# EasyEDA Pro project novadac.eprj, schematic 6-channel DAC for Data General

## Sheets
1 P1: Board Name: Board1; Create Date: 2026-02-04; Page Name: P1; Project Name: novadac; Schematic Name: 6-channel DAC for Data General; Update Date: 2026-02-23; Company: Gata Deneral; Drawn: Ø. Hammer; Page Size: A4; Version: V1.0
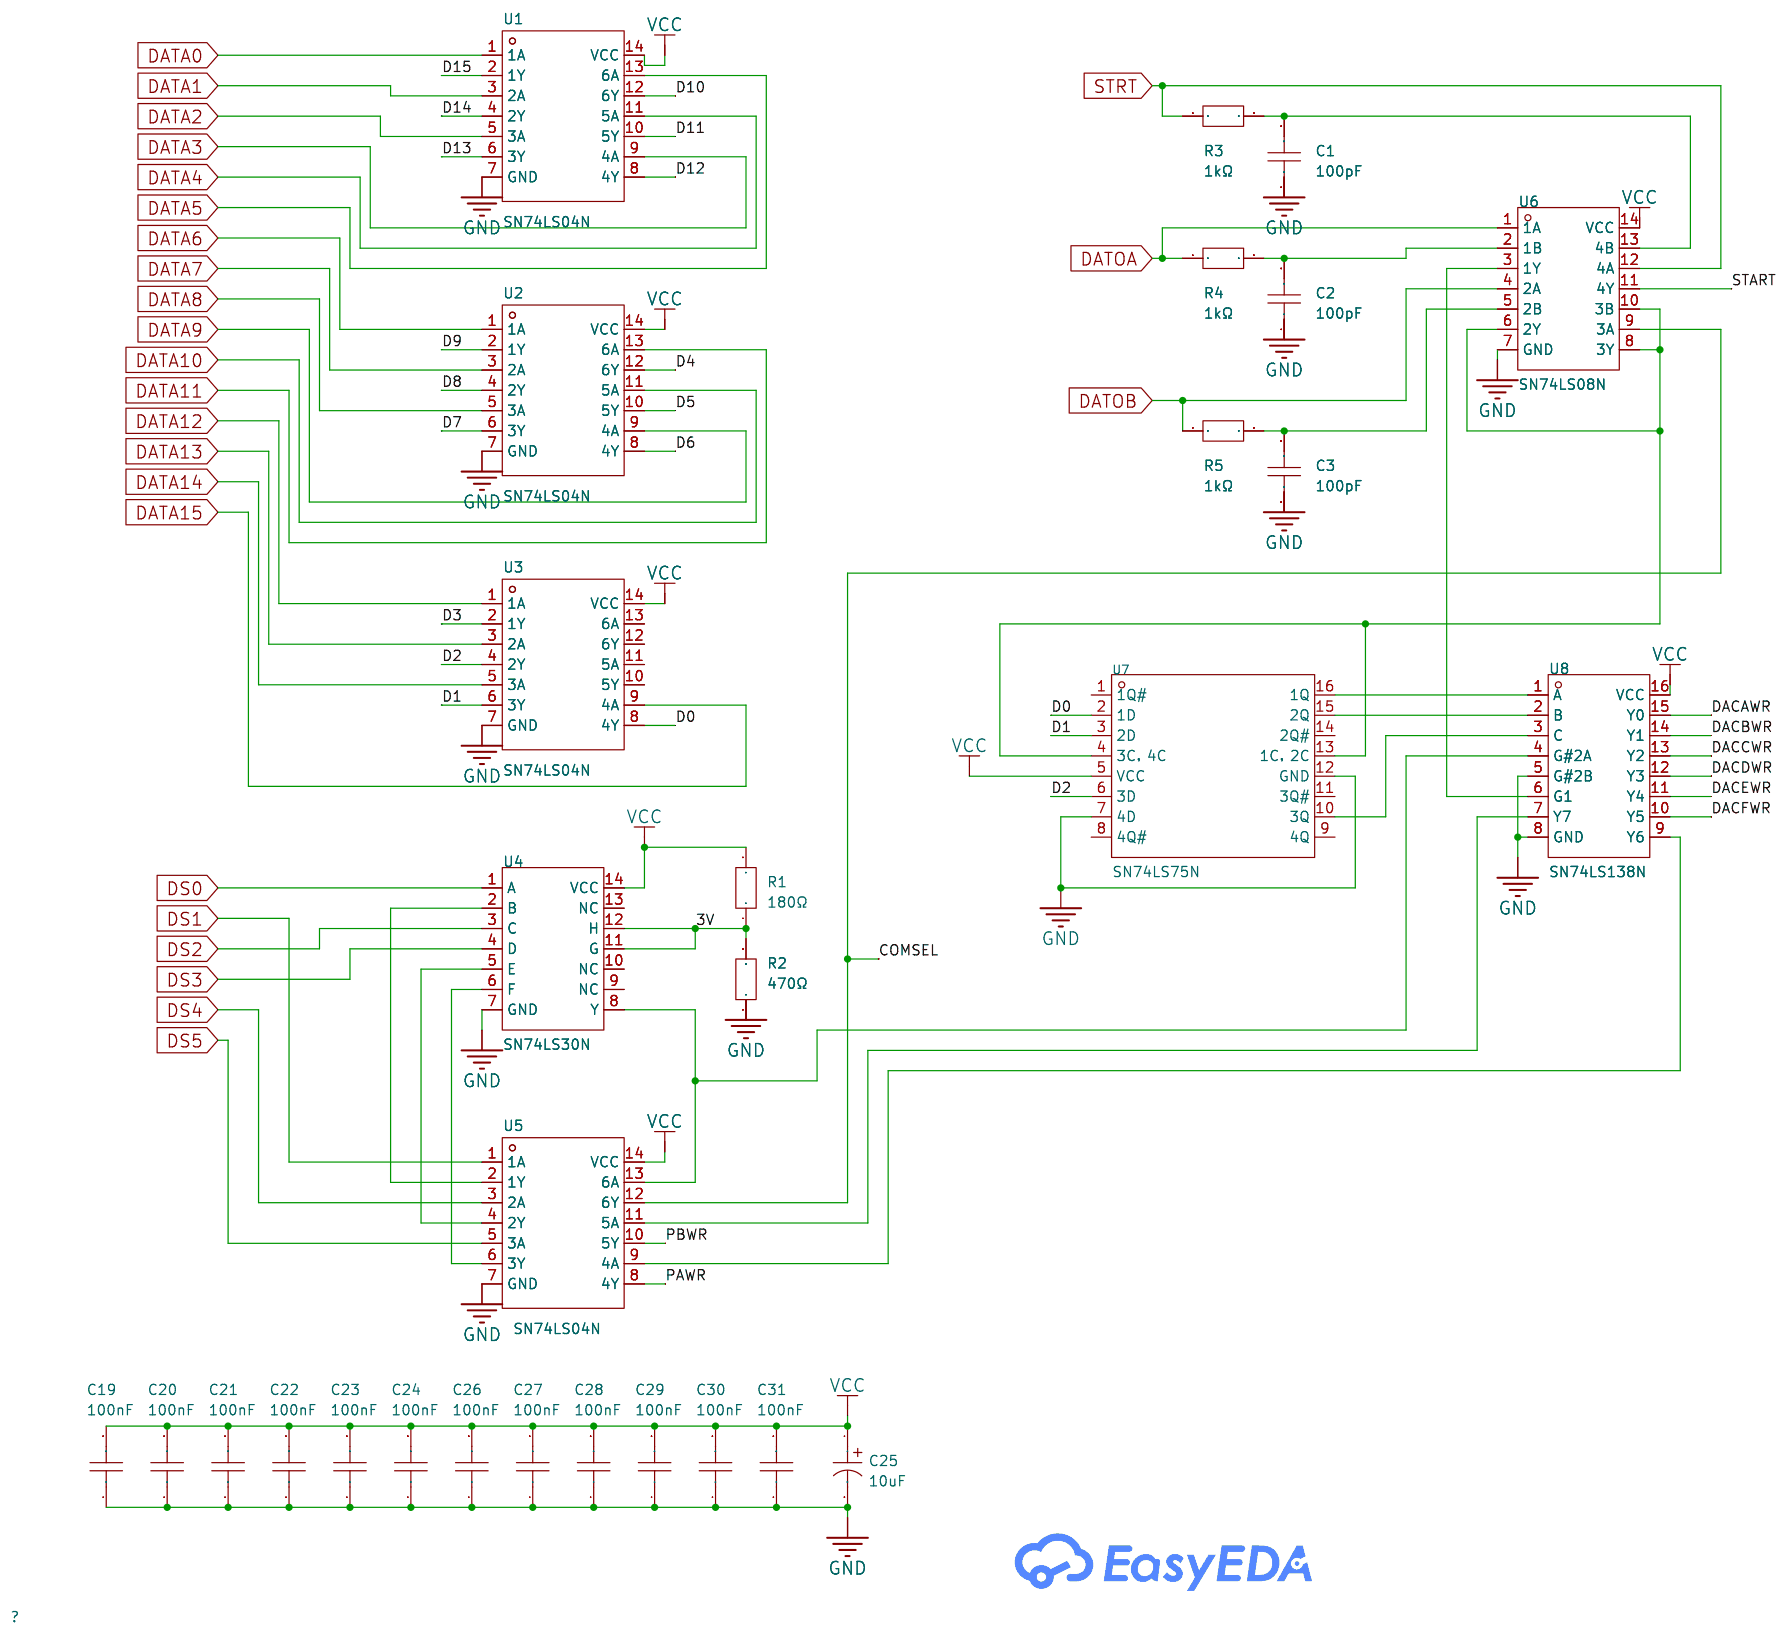
[diagram p0: P1]
2 P2: Create Date: 2026-02-21; Page Name: P2; Update Date: 2026-02-24; Company: EasyEDA.com
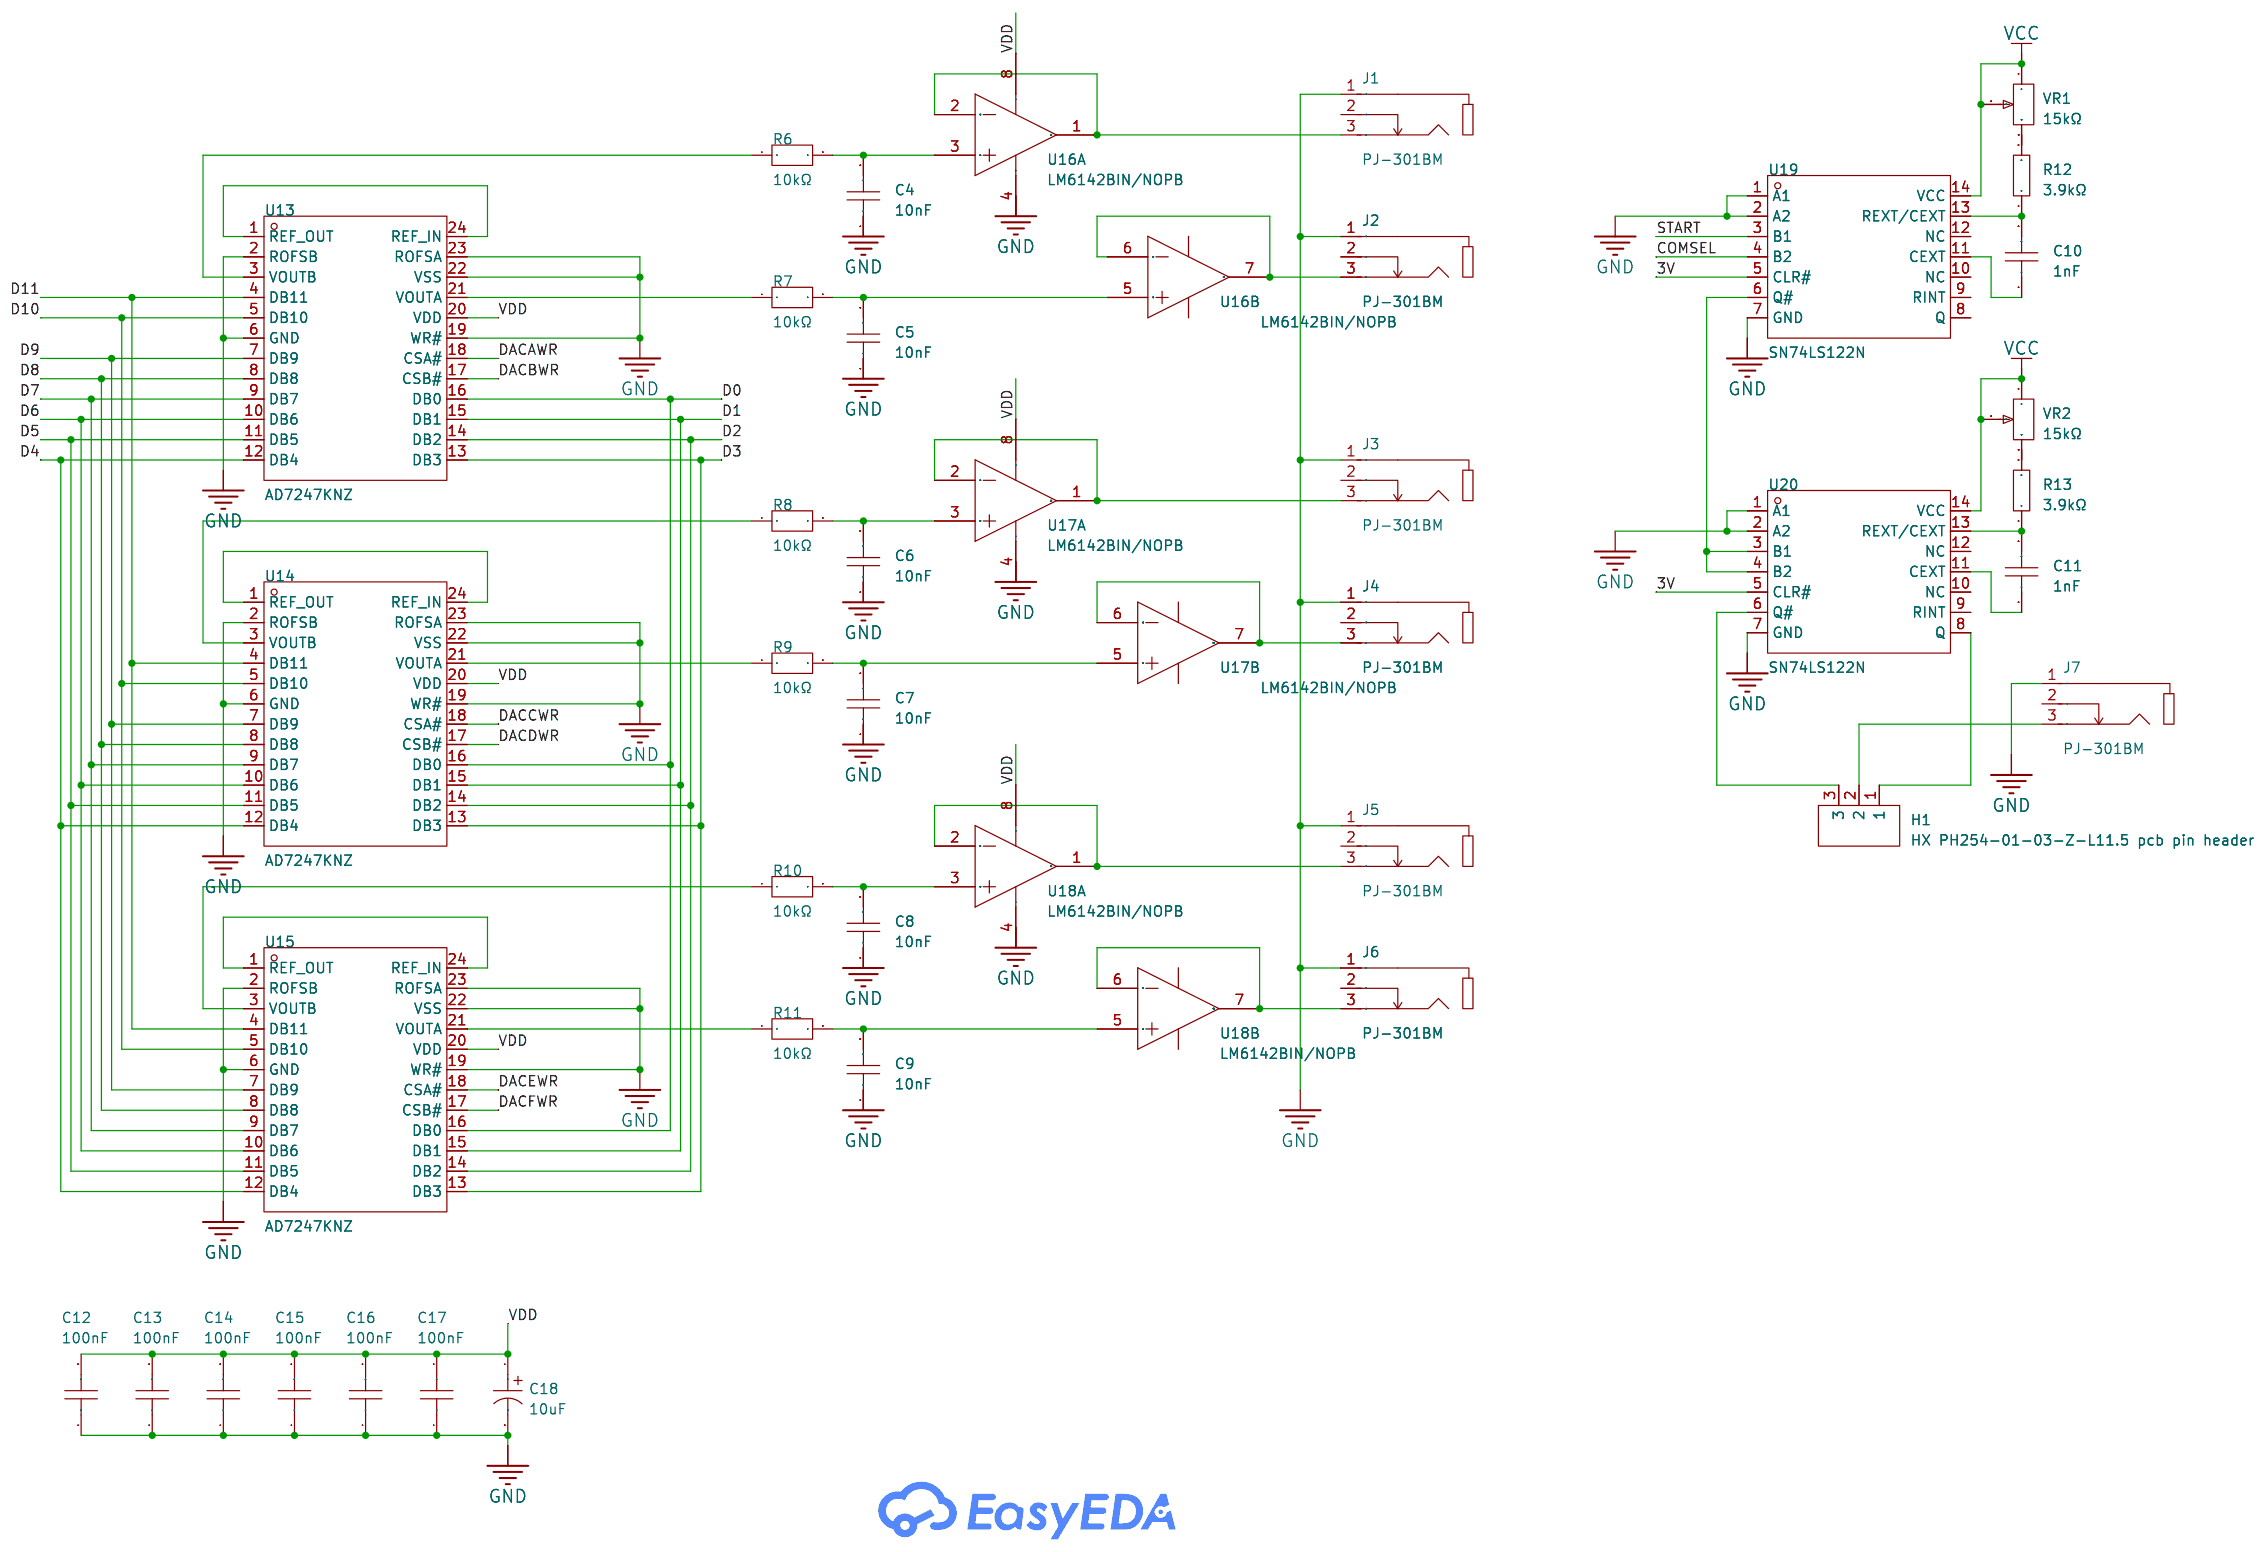
[diagram p1: P2]
3 P3: Create Date: 2026-02-23; Page Name: P3; Update Date: 2026-02-24; Company: EasyEDA.com
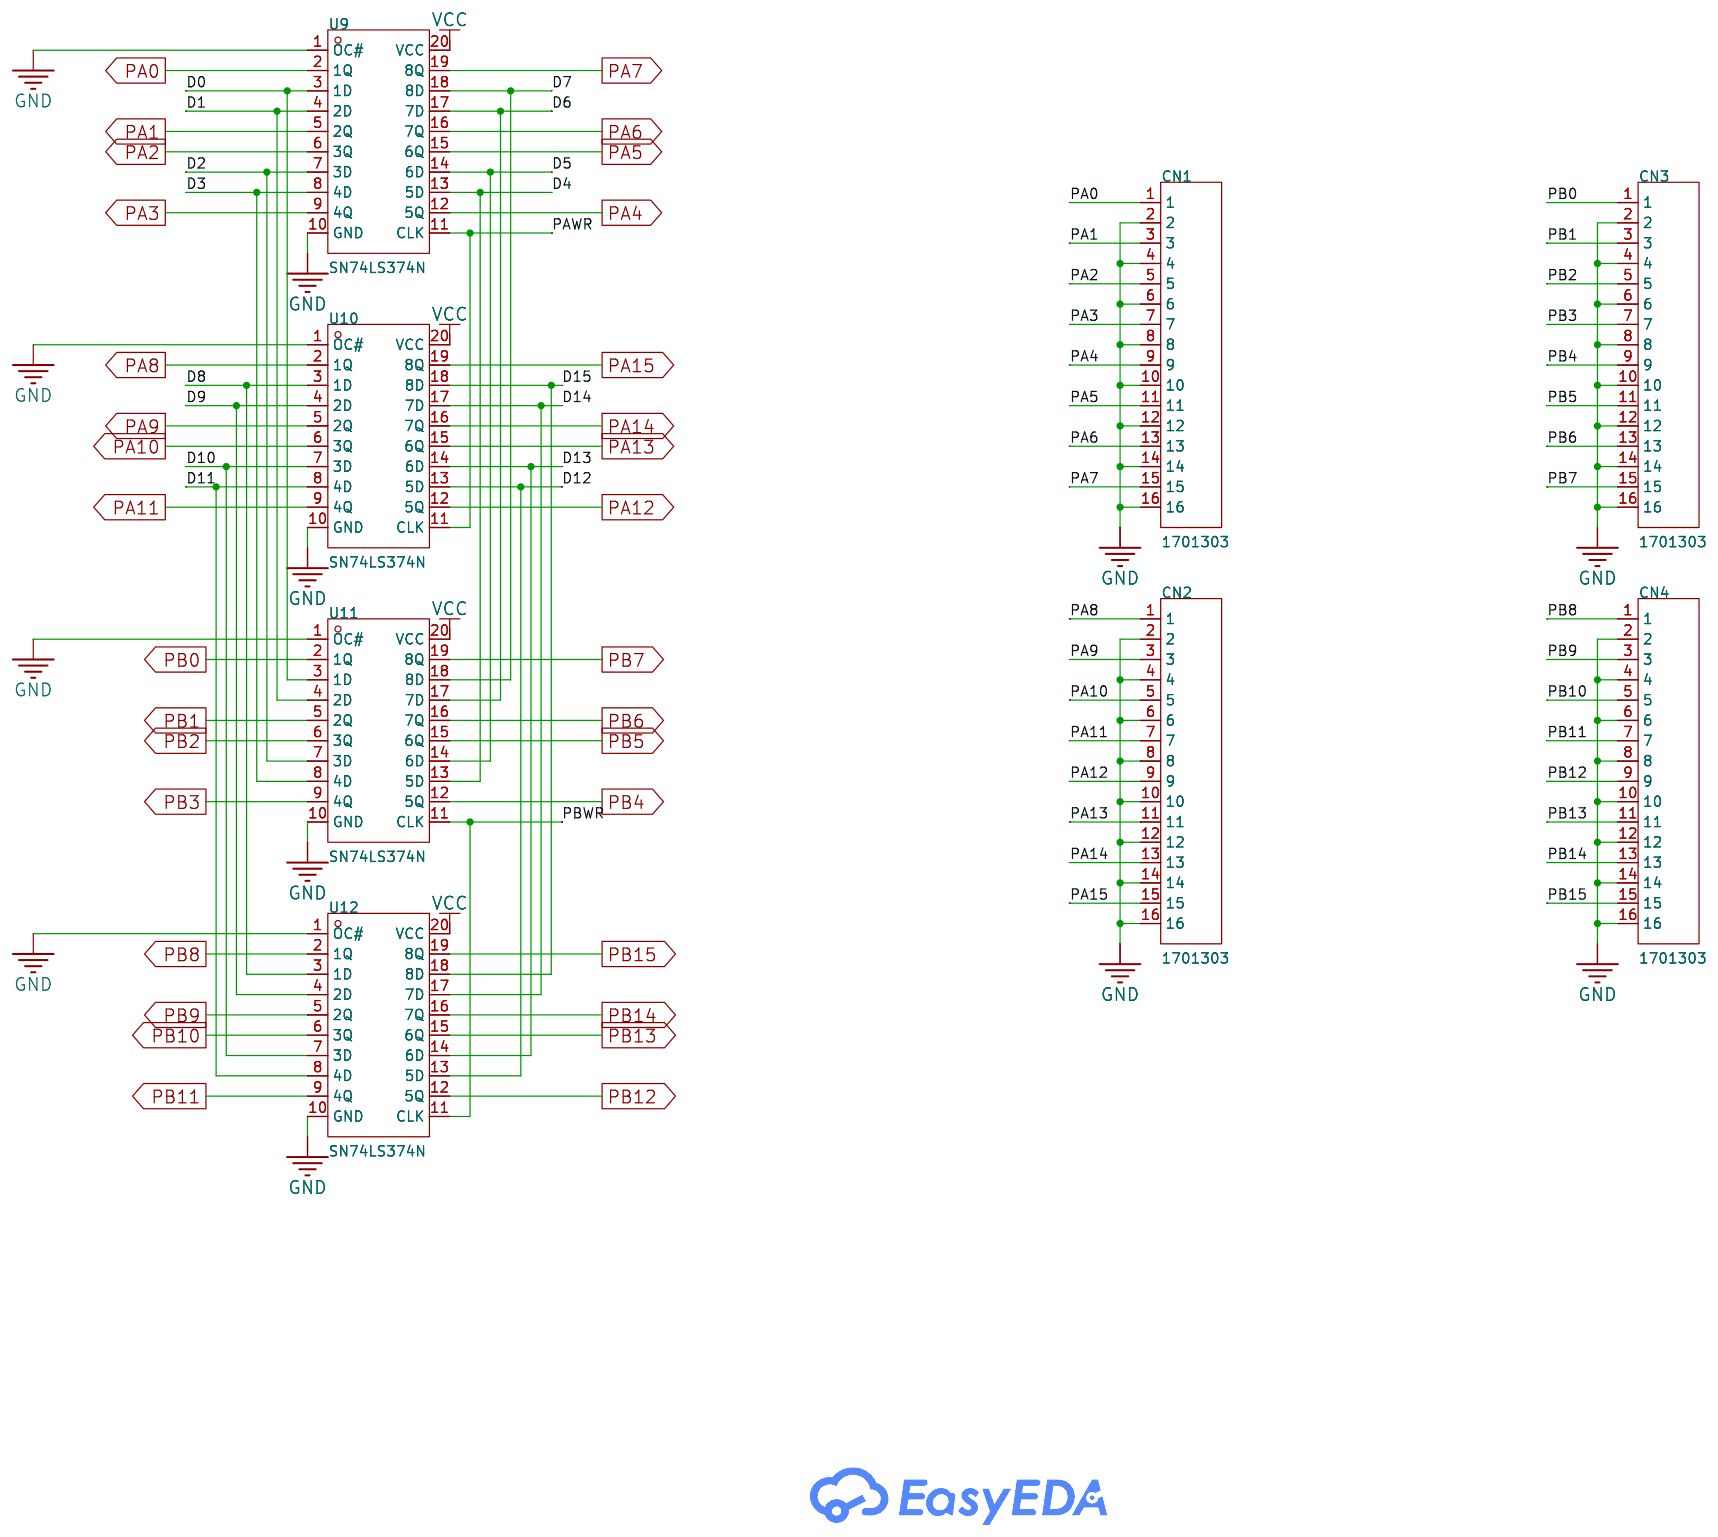
[diagram p2: P3]

## Parts
sheet P1
C1  100pF  [CAP-TH_L6.3-W2.6-P5.08-D0.5]
C2  100pF  [CAP-TH_L6.3-W2.6-P5.08-D0.5]
C3  100pF  [CAP-TH_L6.3-W2.6-P5.08-D0.5]
C19  100nF  [CAP-TH_L6.5-W4.0-P5.00-D0.6-S1.20]
C20  100nF  [CAP-TH_L6.5-W4.0-P5.00-D0.6-S1.20]
C21  100nF  [CAP-TH_L6.5-W4.0-P5.00-D0.6-S1.20]
C22  100nF  [CAP-TH_L6.5-W4.0-P5.00-D0.6-S1.20]
C23  100nF  [CAP-TH_L6.5-W4.0-P5.00-D0.6-S1.20]
C24  100nF  [CAP-TH_L6.5-W4.0-P5.00-D0.6-S1.20]
C25  10uF  [CAP-TH_BD5.0-P2.00-D0.5-FD]
C26  100nF  [CAP-TH_L6.5-W4.0-P5.00-D0.6-S1.20]
C27  100nF  [CAP-TH_L6.5-W4.0-P5.00-D0.6-S1.20]
C28  100nF  [CAP-TH_L6.5-W4.0-P5.00-D0.6-S1.20]
C29  100nF  [CAP-TH_L6.5-W4.0-P5.00-D0.6-S1.20]
C30  100nF  [CAP-TH_L6.5-W4.0-P5.00-D0.6-S1.20]
C31  100nF  [CAP-TH_L6.5-W4.0-P5.00-D0.6-S1.20]
R1  180Ω  [RES-TH_BD2.3-L6.0-P10.00-D0.4]
R2  470Ω  [RES-TH_BD2.5-L6.8-P10.50-D0.5]
R3  1kΩ  [RES-TH_BD2.4-L6.5-P10.50-D0.5]
R4  1kΩ  [RES-TH_BD2.4-L6.5-P10.50-D0.5]
R5  1kΩ  [RES-TH_BD2.4-L6.5-P10.50-D0.5]
U1  SN74LS04N  [PDIP-14_L19.7-W6.6-P2.54-LS8.3-BL]
U2  SN74LS04N  [PDIP-14_L19.7-W6.6-P2.54-LS8.3-BL]
U3  SN74LS04N  [PDIP-14_L19.7-W6.6-P2.54-LS8.3-BL]
U4  SN74LS30N  [PDIP-14_L19.6-W6.5-P2.54-LS7.9-BL]
U5  SN74LS04N  [PDIP-14_L19.7-W6.6-P2.54-LS8.3-BL]
U6  SN74LS08N  [PDIP-14_L19.3-W6.4-P2.54-LS7.9-BL-1]
U7  SN74LS75N  [DIP-16_L20.0-W6.4-P2.54-LS7.6-BL]
U8  SN74LS138N  [DIP-16_L19.8-W6.5-P2.54-LS7.6-BL]
sheet P2
C4  10nF  [CAP-TH_L12.0-W5.0-P7.50-D0.6]
C5  10nF  [CAP-TH_L12.0-W5.0-P7.50-D0.6]
C6  10nF  [CAP-TH_L12.0-W5.0-P7.50-D0.6]
C7  10nF  [CAP-TH_L12.0-W5.0-P7.50-D0.6]
C8  10nF  [CAP-TH_L12.0-W5.0-P7.50-D0.6]
C9  10nF  [CAP-TH_L12.0-W5.0-P7.50-D0.6]
C10  1nF  [CAP-TH_L8.4-W5.0-P6.40-D0.8-S2.5]
C11  1nF  [CAP-TH_L8.4-W5.0-P6.40-D0.8-S2.5]
C12  100nF  [CAP-TH_L6.5-W4.0-P5.00-D0.6-S1.20]
C13  100nF  [CAP-TH_L6.5-W4.0-P5.00-D0.6-S1.20]
C14  100nF  [CAP-TH_L6.5-W4.0-P5.00-D0.6-S1.20]
C15  100nF  [CAP-TH_L6.5-W4.0-P5.00-D0.6-S1.20]
C16  100nF  [CAP-TH_L6.5-W4.0-P5.00-D0.6-S1.20]
C17  100nF  [CAP-TH_L6.5-W4.0-P5.00-D0.6-S1.20]
C18  10uF  [CAP-TH_BD5.0-P2.00-D0.5-FD]
H1  HX PH254-01-03-Z-L11.5 pcb pin header  [HDR-TH_3P-P2.54-V-M-1]
J1  PJ-301BM  [AUDIO-TH_PJ-301BM]
J2  PJ-301BM  [AUDIO-TH_PJ-301BM]
J3  PJ-301BM  [AUDIO-TH_PJ-301BM]
J4  PJ-301BM  [AUDIO-TH_PJ-301BM]
J5  PJ-301BM  [AUDIO-TH_PJ-301BM]
J6  PJ-301BM  [AUDIO-TH_PJ-301BM]
J7  PJ-301BM  [AUDIO-TH_PJ-301BM]
R6  10kΩ  [RES-TH_BD2.3-L6.0-P10.00-D0.6]
R7  10kΩ  [RES-TH_BD2.3-L6.0-P10.00-D0.6]
R8  10kΩ  [RES-TH_BD2.3-L6.0-P10.00-D0.6]
R9  10kΩ  [RES-TH_BD2.3-L6.0-P10.00-D0.6]
R10  10kΩ  [RES-TH_BD2.3-L6.0-P10.00-D0.6]
R11  10kΩ  [RES-TH_BD2.3-L6.0-P10.00-D0.6]
R12  3.9kΩ  [RES-TH_BD2.2-L6.5-P10.50-D0.6]
R13  3.9kΩ  [RES-TH_BD2.2-L6.5-P10.50-D0.6]
U13  AD7247KNZ  [PDIP-24_L32.5-W6.5-P2.54-LS7.9-BL]
U14  AD7247KNZ  [PDIP-24_L32.5-W6.5-P2.54-LS7.9-BL]
U15  AD7247KNZ  [PDIP-24_L32.5-W6.5-P2.54-LS7.9-BL]
U16  LM6142BIN/NOPB  [PDIP-8_L9.6-W6.4-P2.54-LS7.9-BL]  (sections 1,2)
U17  LM6142BIN/NOPB  [PDIP-8_L9.6-W6.4-P2.54-LS7.9-BL]  (sections 1,2)
U18  LM6142BIN/NOPB  [PDIP-8_L9.6-W6.4-P2.54-LS7.9-BL]  (sections 1,2)
U19  SN74LS122N  [PDIP-14_L19.2-W6.6-P2.54-LS7.6-BL]
U20  SN74LS122N  [PDIP-14_L19.2-W6.6-P2.54-LS7.6-BL]
VR1  15kΩ  [RES-ADJ-TH_3362P]
VR2  15kΩ  [RES-ADJ-TH_3362P]
sheet P3
CN1  1701303  [CONN-TH_1701303]
CN2  1701303  [CONN-TH_1701303]
CN3  1701303  [CONN-TH_1701303]
CN4  1701303  [CONN-TH_1701303]
U9  SN74LS374N  [PDIP-20_L25.4-W6.4-P2.54-LS7.6-BL]
U10  SN74LS374N  [PDIP-20_L25.4-W6.4-P2.54-LS7.6-BL]
U11  SN74LS374N  [PDIP-20_L25.4-W6.4-P2.54-LS7.6-BL]
U12  SN74LS374N  [PDIP-20_L25.4-W6.4-P2.54-LS7.6-BL]

## Library data of the parts
C1-C3 = CC1H101JC14DSL6B1100: LCSC Part Name: 100pF ±5% 50V; Supplier Part: C37323966; Manufacturer: Dersonic(德尔创); Supplier Footprint: 插件,P=5.08mm; JLCPCB Part Class: Extended Part; Datasheet: https://item.szlcsc.com/datasheet/CC1H101JC14DSL6B1100/39053442.html; Supplier: LCSC; Tolerance: ±5%; Voltage Rating: 50V; Diameter: 6.3mm; Body Thickness: 2.6mm
C12-C17 C19-C24 C26-C31 = DCS104Z26Y5VF6FJ5A0: LCSC Part Name: 100nF -20%~+80% 50V; Supplier Part: C2896071; Manufacturer: SHM(南方宏明); Supplier Footprint: 插件,P=5mm; JLCPCB Part Class: Extended Part; Datasheet: https://item.szlcsc.com/datasheet/DCS104Z26Y5VF6FJ5A0/3138620.html; Supplier: LCSC; Tolerance: -20%~+80%; Voltage Rating: 50V; Pin Spacing: 5mm; Temperature Coefficient: Y5V
C18 C25 = ECA-1HHG100I: LCSC Part Name: 10uF ±20% 50V; Supplier Part: C1579480; Manufacturer: PANASONIC(松下); Supplier Footprint: 插件,D5xL11mm; JLCPCB Part Class: Extended Part; Datasheet: https://item.szlcsc.com/datasheet/ECA-1HHG100I/1670295.html; Supplier: LCSC; Tolerance: ±20%; Voltage Rating: 50V; Ripple Current: 78mA@100kHz; Pin Spacing: 2.5mm; Diameter: 5mm; Height - Seated (Max): 11mm; Lifetime: 1000hrs@105℃; Operating Temperature: -55℃~+105℃
R1 = CF14JT180R: LCSC Part Name: 碳膜电阻 180Ω ±5% 250mW; Supplier Part: C2441444; Manufacturer: SEI(Stackpole Electronics Inc.); Supplier Footprint: 插件,D2.3xL6mm; JLCPCB Part Class: Extended Part; Datasheet: https://atta.szlcsc.com/upload/public/pdf/source/20210415/C3B0A20144BFAD658339FB54402F100E.pdf; Supplier: LCSC; Type: Carbon Resister; Tolerance: ±5%; Power(Watts): 0.25W; Temperature Coefficient: -400ppm/℃~0ppm/℃; Operating Temperature Range: -55℃~+155℃
R2 = OK4715E-R52: LCSC Part Name: 碳膜电阻 470Ω ±5% 250mW; Supplier Part: C2585640; Manufacturer: Ohmite; Supplier Footprint: 插件,D2.5xL6.8mm; JLCPCB Part Class: Extended Part; Datasheet: https://atta.szlcsc.com/upload/public/pdf/source/20210606/44E8E817E1A17D88343A8FCFA8E94EF6.pdf; Supplier: LCSC; Type: Carbon Resister; Tolerance: ±5%; Power(Watts): 0.25W; Temperature Coefficient: -450ppm/℃
R3-R5 = PRNF14FTD1K00: LCSC Part Name: 金属膜电阻 1kΩ ±1% 250mW; Supplier Part: C2587677; Manufacturer: SEI(Stackpole Electronics Inc.); Supplier Footprint: 插件,D2.4xL6.4mm; JLCPCB Part Class: Extended Part; Datasheet: https://atta.szlcsc.com/upload/public/pdf/source/20210416/CE3C3DFE1F0E2A8D22EC743938724C43.pdf; Supplier: LCSC; Type: Metal Film Resistors; Tolerance: ±1%; Power(Watts): 0.25W; Temperature Coefficient: ±100ppm/℃; Operating Temperature Range: -55℃~+155℃
U1-U3 U5 = SN74LS04N: Supplier Part: C183657; Manufacturer: TI(德州仪器); Supplier Footprint: PDIP-14; JLCPCB Part Class: Extended Part; Datasheet: https://www.ti.com/cn/lit/gpn/sn74ls04; Supplier: LCSC; Voltage - Supply: 4.75V~5.25V; Number of Circuits: 6; Number of Inputs: 1; Current - Output Low(IOL): 8mA; Current - Output High(IOH): 400uA; Input Logic Level - High: 2V; Input Logic Level -Low: 800mV; Max Propagation Delay: 15ns@5V,15pF; Series: 74LSSeries; Operating Temperature: 0℃~+70℃
U4 = SN74LS30N: LCSC Part Name: 八输入正与非门; Supplier Part: C2879098; Manufacturer: TI(德州仪器); Supplier Footprint: PDIP-14; JLCPCB Part Class: Extended Part; Datasheet: https://www.ti.com/cn/lit/gpn/sn5430; Supplier: LCSC; Logic Type: NAND Gate; Number of Channels: 1; Voltage - Supply: 4.75V~5.25V; Quiescent Current: 500uA; Current - Output Low(IOL): 8mA; Current - Output High(IOH): 400uA; Input Logic Level - High: 2V; Input Logic Level - Low: 800mV; Output Logic Level - High: 2.7V~3.4V; Output Logic Level - Low: 500mV; Series: 74LS Series; Propagation Delay: 20ns@5V,15pF; Operating Temperature: 0℃~+70℃; Input Number: 8
U6 = SN74LS08N: Supplier Part: C2869595; Manufacturer: TI(德州仪器); Supplier Footprint: PDIP-14; JLCPCB Part Class: Extended Part; Datasheet: https://www.ti.com/cn/lit/gpn/sn54s08; Supplier: LCSC; Logic Type: AND Gate; Number of Channels: 4; Voltage - Supply: 4.75V~5.25V; Current - Output Low(IOL): 8mA; Current - Output High(IOH): 400uA; Input Logic Level - High: 2V; Input Logic Level - Low: 800mV; Series: 74LSSeries; Operating Temperature: 0℃~+70℃
U7 = SN74LS75N: LCSC Part Name: 差分输出D型锁存器; Supplier Part: C133843; Manufacturer: TI(德州仪器); Supplier Footprint: DIP-16; JLCPCB Part Class: Extended Part; Datasheet: https://www.ti.com/cn/lit/gpn/sn74ls75; Supplier: LCSC; Logic Type: D-Typelocking器; Output Type: Differential; Supply Voltage: 4.75V~5.25V; Source Current: 400uA; Sink Current: 8mA; Propagation Delay: 9ns; OperatingTemperature: 0℃~+70℃
U8 = SN74LS138N: Supplier Part: C352964; Manufacturer: TI(德州仪器); Supplier Footprint: DIP-16; JLCPCB Part Class: Extended Part; Datasheet: https://www.ti.com/cn/lit/gpn/sn74ls138; Supplier: LCSC; Type: Decoder; Voltage Supply Source: Single Supply; Voltage - Supply: 4.75V~5.25V; Current - Output Low(IOL): 8mA; Current - Output High(IOH): 400uA; Operating temperature: 0℃~+70℃; Propagation Delay: 41ns@5V,15pF; Quiescent Current: 10mA
C4-C9 = CT81-M12Y5V1D103MSE: LCSC Part Name: 10nF ±20% 2kV; Supplier Part: C2961300; Manufacturer: FH(风华); Supplier Footprint: 插件,P=7.5mm; JLCPCB Part Class: Extended Part; Datasheet: https://item.szlcsc.com/datasheet/CT81-M12Y5V1D103MSE/3349498.html; Supplier: LCSC; Tolerance: ±20%; Voltage Rating: 2kV; Pin Spacing: 7.5mm; Temperature Coefficient: Y5V
C10 C11 = 564R30GAD10: LCSC Part Name: 1nF ±20% 3kV; Supplier Part: C1621681; Manufacturer: VISHAY(威世); Supplier Footprint: 插件,P=6.4mm; JLCPCB Part Class: Extended Part; Datasheet: https://item.szlcsc.com/datasheet/564R30GAD10/1712527.html; Supplier: LCSC; Tolerance: ±20%; Voltage Rating: 3kV; Pin Spacing: 6.4mm; Temperature Coefficient: Z5U; Diameter: 8.4mm
H1 = HX PH254-01-03-Z-L11.5 pcb pin header: LCSC Part Name: 1x3P 间距:2.54mm 方针 直插; Supplier Part: C52016391; Manufacturer: hanxia(韩下); Supplier Footprint: 插件,P=2.54mm; JLCPCB Part Class: Extended Part; Datasheet: https://item.szlcsc.com/datasheet/HX%2520PH254-01-03-Z-L11.5%2520pcb%2520pin%2520header/54760436.html; Supplier: LCSC; Pin Structure: 1x3P; Pitch: 2.54mm; Circluar Pins/Square Pins: Pin Header; Mounting Type: Through Hole; Number of Rows: 1; Number of Pins: 3P; Current Rating: 3A; Voltage Rating (Max): 1kV; Length of Mating Pin: 6mm; Insulation Height: 2.5mm; Length of End Connection Pin: 3mm; Contact Material: Brass; Contact Plating: Gold; Operating Temperature: -40℃~+105℃
J1-J7 = PJ-301BM: Supplier Part: C5449358; Supplier Footprint: 3.5mmJack; JLCPCB Part Class: Extended Part; Supplier: LCSC
R6-R11 = PCF14JA4K70: LCSC Part Name: 碳膜电阻 4.7kΩ ±5% 250mW; Supplier Part: C2643539; Manufacturer: SEI(Stackpole Electronics Inc.); Supplier Footprint: 插件,D2.3xL6mm; JLCPCB Part Class: Extended Part; Datasheet: https://atta.szlcsc.com/upload/public/pdf/source/20210415/C3B0A20144BFAD658339FB54402F100E.pdf; Supplier: LCSC; Type: Carbon Resister; Tolerance: ±5%; Power(Watts): 0.25W; Temperature Coefficient: -400ppm/℃~0ppm/℃; Operating Temperature Range: -55℃~+155℃
R12 R13 = MFR-25FTE52-3K9: LCSC Part Name: 金属膜电阻 3.9kΩ ±1% 250mW 铜脚，圆柱状直插; Supplier Part: C173016; Manufacturer: YAGEO(国巨); Supplier Footprint: 插件,D2.4xL6.3mm; JLCPCB Part Class: Extended Part; Datasheet: https://atta.szlcsc.com/upload/public/pdf/source/20191118/C457825_18355E864DE4965678DC27B0EBC3E21E.pdf; Supplier: LCSC; Type: Metal Film Resistors; Tolerance: ±1%; Power(Watts): 250mW; Temperature Coefficient: ±50ppm/℃; Operating Temperature: -55℃~+155℃
U13-U15 = AD7247KNZ: LCSC Part Name: 双通道12位DACPORT，采用并行加载结构; Supplier Part: C650711; Manufacturer: ADI(亚德诺); Supplier Footprint: PDIP-24; JLCPCB Part Class: Extended Part; Datasheet: https://atta.szlcsc.com/upload/public/pdf/source/20220519/CFA01A62AC52BA1354AA6BF420D4E076.pdf; Supplier: LCSC; Resolution: 12 Bits; Interface: Parallel; Supply Voltage: 15V; Settling Time: 10us; Output Type: Voltage Buffer; Integral nonlinearity: 0.5LSB；0.9LSB; Operating Temperature: -40℃~+85℃
U16-U18 = LM6142BIN/NOPB: LCSC Part Name: 17 MHz 轨到轨输入输出运算放大器; Supplier Part: C1347342; Manufacturer: TI(德州仪器); Supplier Footprint: PDIP-8; JLCPCB Part Class: Extended Part; Datasheet: https://www.ti.com/cn/lit/gpn/lm6144; Supplier: LCSC; Number of Channels: 2; Maximum Power Supply Range (Vdd-Vss): 24V; Rail to Rail: Rail-to-Rail Input, Rail-to-Rail Output; Gain Bandwidth Product: 17MHz; Vos - Input Offset Voltage: 3.3mV; Input Offset Voltage Drift(Vos TC): 3uV/℃; Slew Rate: 25V/us; Ib - Input Bias Current: 170nA; Input Offset Current(Ios): 80nA; Noise density(eN): 16nV/√Hz@1kHz; Common Mode Rejection Ratio(CMRR): 84dB; Quiescent Current: 650uA; Output Current: 35mA; Operating Temperature: -40℃~+85℃; Single supply: 1.8V~24V
U19 U20 = SN74LS122N: LCSC Part Name: 可触发单稳态多谐振荡器; Supplier Part: C1522780; Manufacturer: TI(德州仪器); Supplier Footprint: PDIP-14; JLCPCB Part Class: Extended Part; Datasheet: https://www.ti.com/cn/lit/gpn/sn74ls122; Supplier: LCSC; Logic Type: Monostable; Voltage - Supply: 4.75V~5.25V; Number Of Channels: 1; Input Type: Schmitt Trigger; Quiescent Current: 11mA; Propagation Delay: 28ns; Current - Output Low(IOL): 8mA; Current - Output High(IOH): 400uA; Logic Family: 74LS; Operating Temperature: 0℃~+70℃; Function: 重触发
VR1 VR2 = 3362P-1-103LF: LCSC Part Name: 10kΩ ±10%; Supplier Part: C58159; Manufacturer: BOURNS; Supplier Footprint: 插件-3P,7x6.6mm; JLCPCB Part Class: Extended Part; Datasheet: https://item.szlcsc.com/datasheet/3362P-1-103LF/59198.html; Supplier: LCSC; Tolerance: ±10%; Power(Watts): 500mW; Temperature Coefficient: ±100ppm/℃
CN1-CN4 = 1701303: LCSC Part Name: 5.08mm 排数:1 每排P数:16 直插; Supplier Part: C5872775; Manufacturer: Phoenix Contact(菲尼克斯); Supplier Footprint: 插件,P=5.08mm; JLCPCB Part Class: Extended Part; Datasheet: https://item.szlcsc.com/datasheet/1701303/6806393.html; Supplier: LCSC; Pitch: 5.08mm; Color: Green; Mounting Type: Through Hole; Number of Pins: 16P; Number of Rows: 1; Number of PINs Per Row: 16; Current Rating: 15A; Voltage Rating (Max): 300V
U9-U12 = SN74LS374N: LCSC Part Name: 八位D型透明锁存器和边沿触发触发器; Supplier Part: C1523200; Manufacturer: TI(德州仪器); Supplier Footprint: PDIP-20; JLCPCB Part Class: Extended Part; Datasheet: https://www.ti.com/cn/lit/gpn/sn74ls374; Supplier: LCSC; Type: D-Type; Trigger Type: Rising Edge; Voltage - Supply: 4.75V~5.25V; Clock Frequency: 50MHz; Number of Elements: 1; Number of Bits per Element: 8; Output Type: Tri-State; Propagation Delay: 28ns@5V,45pF; Series: 74LS Series; Current - Output Low(IOL): 24mA; Current - Output High(IOH): 2.6mA; Quiescent Current: 40mA; Operating Temperature: 0℃~+70℃; Setup Time: 20ns; Hold Time: 0ns

## Nets
3V: R1.1 R2.2 U4.11(G) U4.12(H) U19.5(CLR#) U20.5(CLR#)
GND: C1.1 C2.1 C3.1 C4.1 C5.1 C6.1 C7.1 C8.1 C9.1 C12.1 C13.1 C14.1 C15.1 C16.1 C17.1 C18.2 C19.1 C20.1 C21.1 C22.1 C23.1 C24.1 C25.2 C26.1 C27.1 C28.1 C29.1 C30.1 C31.1 CN1.2 CN1.4 CN1.6 CN1.8 CN1.10 CN1.12 CN1.14 CN1.16 CN2.2 CN2.4 CN2.6 CN2.8 CN2.10 CN2.12 CN2.14 CN2.16 CN3.2 CN3.4 CN3.6 CN3.8 CN3.10 CN3.12 CN3.14 CN3.16 CN4.2 CN4.4 CN4.6 CN4.8 CN4.10 CN4.12 CN4.14 CN4.16 J1.1 J2.1 J3.1 J4.1 J5.1 J6.1 J7.1 R2.1 U1.7(GND) U2.7(GND) U3.7(GND) U4.7(GND) U5.7(GND) U6.7(GND) U7.7(4D) U7.12(GND) U8.5(G#2B) U8.8(GND) U9.1(OC#) U9.10(GND) U10.1(OC#) U10.10(GND) U11.1(OC#) U11.10(GND) U12.1(OC#) U12.10(GND) U13.2(ROFSB) U13.6(GND) U13.19(WR#) U13.22(VSS) U13.23(ROFSA) U14.2(ROFSB) U14.6(GND) U14.19(WR#) U14.22(VSS) U14.23(ROFSA) U15.2(ROFSB) U15.6(GND) U15.19(WR#) U15.22(VSS) U15.23(ROFSA) U16.4(V-) U17.4(V-) U18.4(V-) U19.1(A1) U19.2(A2) U19.7(GND) U20.1(A1) U20.2(A2) U20.7(GND)
VCC: C19.2 C20.2 C21.2 C22.2 C23.2 C24.2 C25.1 C26.2 C27.2 C28.2 C29.2 C30.2 C31.2 R1.2 U1.14(VCC) U2.14(VCC) U3.14(VCC) U4.14(VCC) U5.14(VCC) U6.14(VCC) U7.5(VCC) U8.16(VCC) U9.20(VCC) U10.20(VCC) U11.20(VCC) U12.20(VCC) U19.14(VCC) U20.14(VCC) VR1.1 VR1.2 VR2.1 VR2.2
VDD: C12.2 C13.2 C14.2 C15.2 C16.2 C17.2 C18.1 U13.20(VDD) U14.20(VDD) U15.20(VDD) U16.8(V+) U17.8(V+) U18.8(V+)
COMSEL: U5.12(6Y) U6.9(3A) U19.4(B2)
D0: U3.8(4Y) U7.2(1D) U9.3(1D) U11.3(1D) U13.16(DB0) U14.16(DB0) U15.16(DB0)
D1: U3.6(3Y) U7.3(2D) U9.4(2D) U11.4(2D) U13.15(DB1) U14.15(DB1) U15.15(DB1)
D2: U3.4(2Y) U7.6(3D) U9.7(3D) U11.7(3D) U13.14(DB2) U14.14(DB2) U15.14(DB2)
D3: U3.2(1Y) U9.8(4D) U11.8(4D) U13.13(DB3) U14.13(DB3) U15.13(DB3)
D4: U2.12(6Y) U9.13(5D) U11.13(5D) U13.12(DB4) U14.12(DB4) U15.12(DB4)
D5: U2.10(5Y) U9.14(6D) U11.14(6D) U13.11(DB5) U14.11(DB5) U15.11(DB5)
D6: U2.8(4Y) U9.17(7D) U11.17(7D) U13.10(DB6) U14.10(DB6) U15.10(DB6)
D7: U2.6(3Y) U9.18(8D) U11.18(8D) U13.9(DB7) U14.9(DB7) U15.9(DB7)
D8: U2.4(2Y) U10.3(1D) U12.3(1D) U13.8(DB8) U14.8(DB8) U15.8(DB8)
D9: U2.2(1Y) U10.4(2D) U12.4(2D) U13.7(DB9) U14.7(DB9) U15.7(DB9)
D10: U1.12(6Y) U10.7(3D) U12.7(3D) U13.5(DB10) U14.5(DB10) U15.5(DB10)
D11: U1.10(5Y) U10.8(4D) U12.8(4D) U13.4(DB11) U14.4(DB11) U15.4(DB11)
D12: U1.8(4Y) U10.13(5D) U12.13(5D)
D13: U1.6(3Y) U10.14(6D) U12.14(6D)
D14: U1.4(2Y) U10.17(7D) U12.17(7D)
D15: U1.2(1Y) U10.18(8D) U12.18(8D)
DACAWR: U8.15(Y0) U13.18(CSA#)
DACBWR: U8.14(Y1) U13.17(CSB#)
DACCWR: U8.13(Y2) U14.18(CSA#)
DACDWR: U8.12(Y3) U14.17(CSB#)
DACEWR: U8.11(Y4) U15.18(CSA#)
DACFWR: U8.10(Y5) U15.17(CSB#)
DATA0: U1.1(1A)
DATA1: U1.3(2A)
DATA2: U1.5(3A)
DATA3: U1.9(4A)
DATA4: U1.11(5A)
DATA5: U1.13(6A)
DATA6: U2.1(1A)
DATA7: U2.3(2A)
DATA8: U2.5(3A)
DATA9: U2.9(4A)
DATA10: U2.11(5A)
DATA11: U2.13(6A)
DATA12: U3.1(1A)
DATA13: U3.3(2A)
DATA14: U3.5(3A)
DATA15: U3.9(4A)
DATOA: R4.1 U6.1(1A)
DATOB: R5.1 U6.4(2A)
DS0: U4.1(A)
DS1: U5.1(1A)
DS2: U4.3(C)
DS3: U4.4(D)
DS4: U5.3(2A)
DS5: U5.5(3A)
PA0: CN1.1 U9.2(1Q)
PA1: CN1.3 U9.5(2Q)
PA2: CN1.5 U9.6(3Q)
PA3: CN1.7 U9.9(4Q)
PA4: CN1.9 U9.12(5Q)
PA5: CN1.11 U9.15(6Q)
PA6: CN1.13 U9.16(7Q)
PA7: CN1.15 U9.19(8Q)
PA8: CN2.1 U10.2(1Q)
PA9: CN2.3 U10.5(2Q)
PA10: CN2.5 U10.6(3Q)
PA11: CN2.7 U10.9(4Q)
PA12: CN2.9 U10.12(5Q)
PA13: CN2.11 U10.15(6Q)
PA14: CN2.13 U10.16(7Q)
PA15: CN2.15 U10.19(8Q)
PAWR: U5.8(4Y) U9.11(CLK) U10.11(CLK)
PB0: CN3.1 U11.2(1Q)
PB1: CN3.3 U11.5(2Q)
PB2: CN3.5 U11.6(3Q)
PB3: CN3.7 U11.9(4Q)
PB4: CN3.9 U11.12(5Q)
PB5: CN3.11 U11.15(6Q)
PB6: CN3.13 U11.16(7Q)
PB7: CN3.15 U11.19(8Q)
PB8: CN4.1 U12.2(1Q)
PB9: CN4.3 U12.5(2Q)
PB10: CN4.5 U12.6(3Q)
PB11: CN4.7 U12.9(4Q)
PB12: CN4.9 U12.12(5Q)
PB13: CN4.11 U12.15(6Q)
PB14: CN4.13 U12.16(7Q)
PB15: CN4.15 U12.19(8Q)
PBWR: U5.10(5Y) U11.11(CLK) U12.11(CLK)
START: U6.11(4Y) U19.3(B1)
STRT: R3.1 U6.12(4A)
$1N4042: U4.2(B) U5.2(1Y)
$1N4048: U4.5(E) U5.4(2Y)
$1N4055: U4.6(F) U5.6(3Y)
$1N4893: C3.2 R5.2 U6.5(2B)
$1N4905: C1.2 R3.2 U6.13(4B)
$1N5385: C2.2 R4.2 U6.2(1B)
$1N5398: U6.6(2Y) U6.8(3Y) U6.10(3B) U7.4(3C，4C) U7.13(1C，2C)
$1N5648: U7.16(1Q) U8.1(A)
$1N5652: U7.15(2Q) U8.2(B)
$1N5656: U7.10(3Q) U8.3(C)
$1N5992: U6.3(1Y) U8.6(G1)
$1N6878: U5.11(5A) U8.7(Y7)
$1N6889: U5.9(4A) U8.9(Y6)
$1N11000: U4.8(Y) U5.13(6A) U8.4(G#2A)
$2N957: U13.1(REF OUT) U13.24(REF IN)
$2N968: U14.1(REF OUT) U14.24(REF IN)
$2N978: U15.1(REF OUT) U15.24(REF IN)
$2N1093: R6.1 U13.3(VOUTB)
$2N1103: R8.1 U14.3(VOUTB)
$2N1109: R9.1 U14.21(VOUTA)
$2N1124: R10.1 U15.3(VOUTB)
$2N1478: J1.3 U16.1(OUTA) U16.2(INA-)
$2N1570: J3.3 U17.1(OUTA) U17.2(INA-)
$2N1577: J5.3 U18.1(OUTA) U18.2(INA-)
$2N1586: J4.3 U17.6(-INB) U17.7(OUTB)
$2N1601: J6.3 U18.6(-INB) U18.7(OUTB)
$2N1963: R7.1 U13.21(VOUTA)
$2N2005: R11.1 U15.21(VOUTA)
$2N2011: C4.2 R6.2 U16.3(INA+)
$2N2015: C5.2 R7.2 U16.5(+INB)
$2N2020: C6.2 R8.2 U17.3(INA+)
$2N2025: C7.2 R9.2 U17.5(+INB)
$2N2030: C8.2 R10.2 U18.3(INA+)
$2N2035: C9.2 R11.2 U18.5(+INB)
$2N2404: J2.3 U16.6(-INB) U16.7(OUTB)
$2N2987: C10.2 R12.1 U19.13(REXT/CEXT)
$2N2991: C10.1 U19.11(CEXT)
$2N3069: R12.2 VR1.3
$2N3148: U19.6(Q#) U20.3(B1) U20.4(B2)
$2N3319: R13.2 VR2.3
$2N3321: C11.2 R13.1 U20.13(REXT/CEXT)
$2N3323: C11.1 U20.11(CEXT)
$2N3386: H1.1 U20.8(Q)
$2N3394: H1.3 U20.6(Q#)
$2N3813: H1.2 J7.3

Not connected (* = marked no-connect by the designer): J1 2; J2 2; J3 2; J4 2; J5 2; J6 2; J7 2; U3 10(5Y) 11(5A) 12(6Y) 13(6A); U4 9(NC) 10(NC) 13(NC); U7 1(1Q#) 8(4Q#) 9(4Q) 11(3Q#) 14(2Q#); U19 8(Q) 9(RINT) 10(NC) 12(NC); U20 9(RINT) 10(NC) 12(NC)
